# Altium schematic sheet RF2_Block.SchDoc
size A4; SheetNumber: 9; SheetTotal: 10
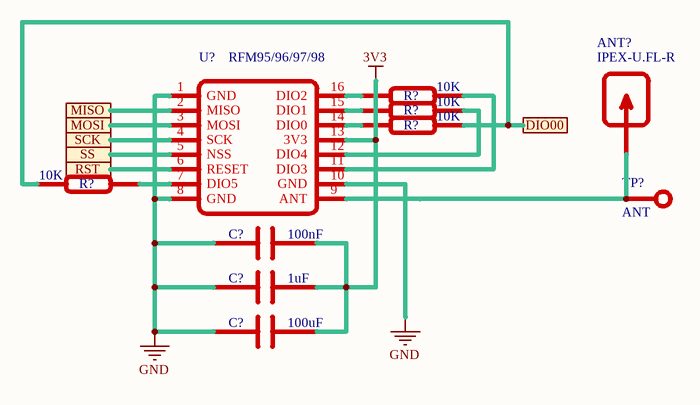
[diagram p0: RF2_Block.SchDoc]

## Parts
(Parts that share a designator on the sheet are numbered #1, #2 ... from top to bottom, then left to right.)
ANT?  IPEX-U.FL-R  [IPEX Connector SMD]
C?#1  100nF  [C0805]
C?#2  1uF  [C0805]
C?#3  100uF  [C0805]
R?#1  10K  [R0805]
R?#2  10K  [R0805]
R?#3  10K  [R0603]
R?#4  10K  [R0603]
TP?  ANT  [Test Point]
U?  RFM95/96/97/98  [LORA RFM95/96/97/98W]

## Ports
DIO00, MISO, MOSI, RST, SCK, SS

## Nets
3V3: C?#1.2 C?#2.2 C?#3.2 U?.13(3V3)
GND: C?#1.1 C?#2.1 C?#3.1 U?.1(GND) U?.8(GND) U?.10(GND)
DIO00: R?#3.2 R?#4.1 ; port DIO00
MISO: U?.2(MISO) ; port MISO
MOSI: U?.3(MOSI) ; port MOSI
RST: U?.6(RESET) ; port RST
SCK: U?.4(SCK) ; port SCK
SS: U?.5(NSS) ; port SS
NetANT?_1: ANT?.1 TP?.1 U?.9(ANT)
NetR?#1_1: R?#1.1 U?.16(DIO2)
NetR?#1_2: R?#1.2 U?.11(DIO3)
NetR?#2_1: R?#2.1 U?.15(DIO1)
NetR?#2_2: R?#2.2 U?.12(DIO4)
NetR?#3_1: R?#3.1 U?.14(DIO0)
NetR?#4_2: R?#4.2 U?.7(DIO5)

Not connected (* = marked no-connect by the designer): ANT? 2(GND)

## Library data of the parts
ANT? = IPEX-U.FL-R: RF Antena; ComponentLink1Description: Datasheets; ComponentLink1URL: https://cdn.taoglas.com/datasheets/RECE.20279.001E.01.pdf
C?#1-C?#3 = CAP-CER: Ceramic Capacitor
R?#1-R?#4 = Resistor
TP? = TestPoint: Test Point
U? = RFM95/96/97/98 LORA Module: The RFM95/96/97/98(W) transceivers feature the LoRaTM    long range modem that provides ultra-long range spread spectrum communication and high interference immunity whilst minimising current consumption.; ComponentLink1Description: RFM95/96/97/98; ComponentLink1URL: https://cdn.sparkfun.com/assets/learn_tutorials/8/0/4/RFM95_96_97_98W.pdf